# Altium schematic sheet LVDS_IFC.SchDoc: Phaser
size 420 x 297 mm; EDA_Number: ARTIQ; Projet: ARTIQ/SINARA; Author: G.Kasprowicz; CompanyName: WUT ISE; DrawnBy: G.Kasprowicz; Organization: WUT ISE; Address1: PW ISE; Address2: Nowowiejska 15/19 00-665 Warsaw; Address3: gkasprow@gmail.com; DocumentNumber: 15; Revision: 2; SheetNumber: 15; SheetTotal: 18; ModifiedBy: -; CheckedDate: -; Title2: EEM connectors; DivGrp: WUT ISE; Designer: G.Kasprowicz; ModifiedDate: -; ProjectName: Sensor Box
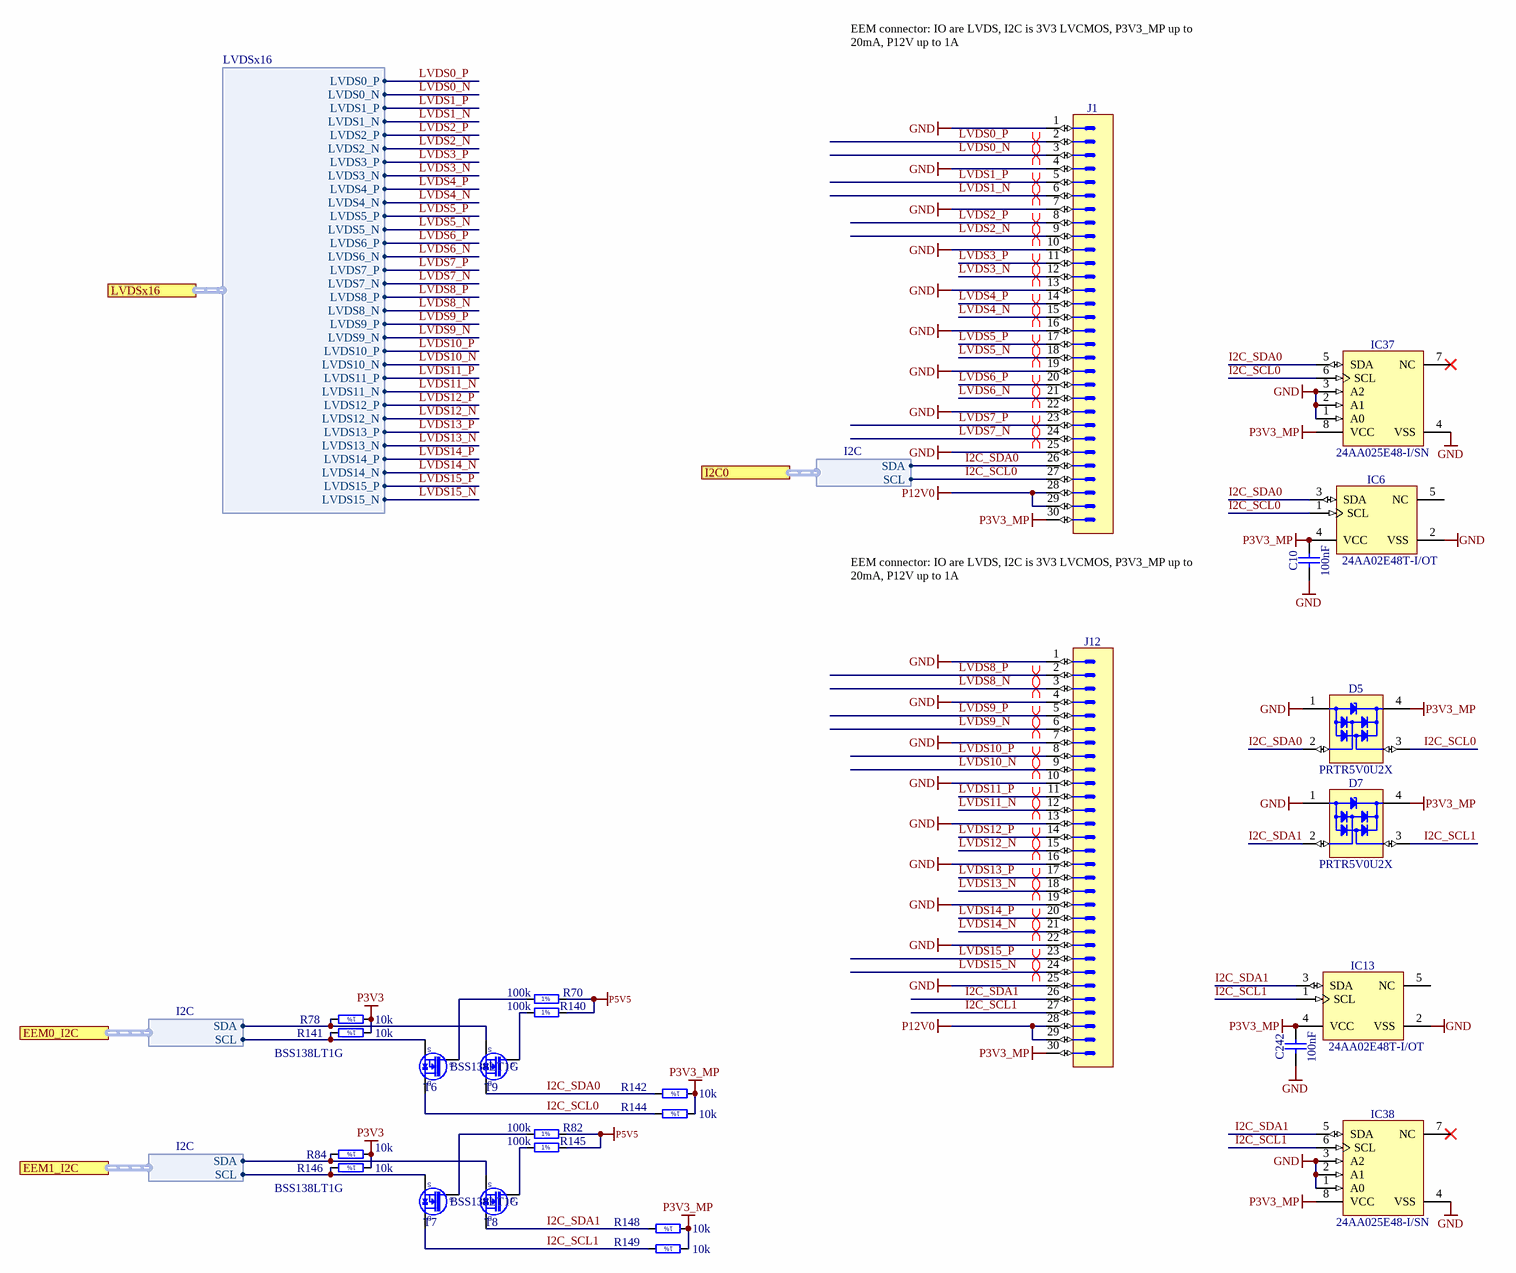
[diagram p0: LVDS_IFC.SchDoc]

## Parts
C10  100nF  [CAPC1005X55N]
C242  100nF  [CAPC1005X55N]
D5  PRTR5V0U2X  [SOT190P230X110-4N]
D7  PRTR5V0U2X  [SOT190P230X110-4N]
IC6  24AA02E48T-I/OT  [SOT95P280X145-5N]
IC13  24AA02E48T-I/OT  [SOT95P280X145-5N]
IC37  24AA025E48-I/SN  [SOIC127P600X175-8N]
IC38  24AA025E48-I/SN  [SOIC127P600X175-8N]
J1  (no value)  [3M_N2530-6002RB]
J12  (no value)  [3M_N2530-6002RB]
R70  100k  [RESC1005X40N]
R78  10k  [RESC1005X40N]
R82  100k  [RESC1005X40N]
R84  10k  [RESC1005X40N]
R140  100k  [RESC1005X40N]
R141  10k  [RESC1005X40N]
R142  10k  [RESC1005X40N]
R144  10k  [RESC1005X40N]
R145  100k  [RESC1005X40N]
R146  10k  [RESC1005X40N]
R148  10k  [RESC1005X40N]
R149  10k  [RESC1005X40N]
T6  BSS138LT1G  [SOT95P240X110-3N]
T7  BSS138LT1G  [SOT95P240X110-3N]
T8  BSS138LT1G  [SOT95P240X110-3N]
T9  BSS138LT1G  [SOT95P240X110-3N]

## Ports
EEM0_I2C (harness I2C), EEM1_I2C (harness I2C), I2C0 (harness I2C), LVDSx16 (harness LVDSx16)

## Harnesses
I2C: SDA, SCL
LVDSx16: LVDS0_P, LVDS0_N, LVDS1_P, LVDS1_N, LVDS2_P, LVDS2_N, LVDS3_P, LVDS3_N, LVDS4_P, LVDS4_N, LVDS5_P, LVDS5_N, LVDS6_P, LVDS6_N, LVDS7_P, LVDS7_N, LVDS8_P, LVDS8_N, LVDS9_P, LVDS9_N, LVDS10_P, LVDS10_N, LVDS11_P, LVDS11_N, LVDS12_P, LVDS12_N, LVDS13_P, LVDS13_N, LVDS14_P, LVDS14_N, LVDS15_P, LVDS15_N

## Nets
GND: C10.1 C242.1 D5.1(GND) D7.1(GND) IC6.2(VSS) IC13.2(VSS) IC37.1(A0) IC37.2(A1) IC37.3(A2) IC37.4(VSS) IC38.1(A0) IC38.2(A1) IC38.3(A2) IC38.4(VSS) J1.1 J1.4 J1.7 J1.10 J1.13 J1.16 J1.19 J1.22 J1.25 J12.1 J12.4 J12.7 J12.10 J12.13 J12.16 J12.19 J12.22 J12.25
P3V3: R78.1 R84.1 R141.1 R146.1
P3V3_MP: C10.2 C242.2 D5.4(VCC) D7.4(VCC) IC6.4(VCC) IC13.4(VCC) IC37.8(VCC) IC38.8(VCC) J1.30 J12.30 R142.1 R144.1 R148.1 R149.1
P5V5: R70.2 R82.2 R140.2 R145.2
P12V0: J1.28 J1.29 J12.28 J12.29
I2C_SCL0: D5.3(I/O2) IC6.1(SCL) IC37.6(SCL) J1.27 R144.2 T6.3(D) ; port I2C0.SCL
I2C_SCL1: D7.3(I/O2) IC13.1(SCL) IC38.6(SCL) J12.27 R149.2 T7.3(D)
I2C_SDA0: D5.2(I/O1) IC6.3(SDA) IC37.5(SDA) J1.26 R142.2 T9.3(D) ; port I2C0.SDA
I2C_SDA1: D7.2(I/O1) IC13.3(SDA) IC38.5(SDA) J12.26 R148.2 T8.3(D)
LVDS0_N: J1.3 ; port LVDSx16.LVDS0_N
LVDS0_P: J1.2 ; port LVDSx16.LVDS0_P
LVDS1_N: J1.6 ; port LVDSx16.LVDS1_N
LVDS1_P: J1.5 ; port LVDSx16.LVDS1_P
LVDS2_N: J1.9 ; port LVDSx16.LVDS2_N
LVDS2_P: J1.8 ; port LVDSx16.LVDS2_P
LVDS3_N: J1.12 ; port LVDSx16.LVDS3_N
LVDS3_P: J1.11 ; port LVDSx16.LVDS3_P
LVDS4_N: J1.15 ; port LVDSx16.LVDS4_N
LVDS4_P: J1.14 ; port LVDSx16.LVDS4_P
LVDS5_N: J1.18 ; port LVDSx16.LVDS5_N
LVDS5_P: J1.17 ; port LVDSx16.LVDS5_P
LVDS6_N: J1.21 ; port LVDSx16.LVDS6_N
LVDS6_P: J1.20 ; port LVDSx16.LVDS6_P
LVDS7_N: J1.24 ; port LVDSx16.LVDS7_N
LVDS7_P: J1.23 ; port LVDSx16.LVDS7_P
LVDS8_N: J12.3 ; port LVDSx16.LVDS8_N
LVDS8_P: J12.2 ; port LVDSx16.LVDS8_P
LVDS9_N: J12.6 ; port LVDSx16.LVDS9_N
LVDS9_P: J12.5 ; port LVDSx16.LVDS9_P
LVDS10_N: J12.9 ; port LVDSx16.LVDS10_N
LVDS10_P: J12.8 ; port LVDSx16.LVDS10_P
LVDS11_N: J12.12 ; port LVDSx16.LVDS11_N
LVDS11_P: J12.11 ; port LVDSx16.LVDS11_P
LVDS12_N: J12.15 ; port LVDSx16.LVDS12_N
LVDS12_P: J12.14 ; port LVDSx16.LVDS12_P
LVDS13_N: J12.18 ; port LVDSx16.LVDS13_N
LVDS13_P: J12.17 ; port LVDSx16.LVDS13_P
LVDS14_N: J12.21 ; port LVDSx16.LVDS14_N
LVDS14_P: J12.20 ; port LVDSx16.LVDS14_P
LVDS15_N: J12.24 ; port LVDSx16.LVDS15_N
LVDS15_P: J12.23 ; port LVDSx16.LVDS15_P
NetR70_1: R70.1 T6.1(G)
NetR78_2: R78.2 T9.2(S) ; port EEM0_I2C.SDA
NetR82_1: R82.1 T7.1(G)
NetR84_2: R84.2 T8.2(S) ; port EEM1_I2C.SDA
NetR140_1: R140.1 T9.1(G)
NetR141_2: R141.2 T6.2(S) ; port EEM0_I2C.SCL
NetR145_1: R145.1 T8.1(G)
NetR146_2: R146.2 T7.2(S) ; port EEM1_I2C.SCL

Not connected (* = marked no-connect by the designer): IC6 5(NC); IC13 5(NC); IC37 7(NC)*; IC38 7(NC)*

## Layout directives
differential pair; differential pair class EEM0; net class EEM0: LVDS0_N, LVDS0_P, LVDS1_N, LVDS1_P, LVDS2_N, LVDS2_P, LVDS3_N, LVDS3_P, LVDS4_N, LVDS4_P, LVDS5_N, LVDS5_P, LVDS6_N, LVDS6_P, LVDS7_N, LVDS7_P
differential pair; differential pair class EEM1; net class EEM1: LVDS8_N, LVDS8_P, LVDS9_N, LVDS9_P, LVDS10_N, LVDS10_P, LVDS11_N, LVDS11_P, LVDS12_N, LVDS12_P, LVDS13_N, LVDS13_P, LVDS14_N, LVDS14_P, LVDS15_N, LVDS15_P
differential pair; differential pair class EEM1: LVDS11_P

## Notes on the sheet
- (near J1) EEM connector: IO are LVDS, I2C is 3V3 LVCMOS, P3V3_MP up to 20mA, P12V up to 1A
- EEM connector: IO are LVDS, I2C is 3V3 LVCMOS, P3V3_MP up to 20mA, P12V up to 1A
- Project/Equipment
- Document
- Designer
- Drawn by
- Check.by
- Copyright WUT ISE 2018.
  This documentation describes Open Hardware and is licensed under the CERN OHL v.1.1. You may redistribute and modify this documentation under the terms of the CERN OHL v.1.1. (http://ohwr.org/CERNOHL). This documentation is distributed WITHOUT ANY EXPRESS OR IMPLIED WARRANTY, INCLUDING OF MERCHANTABILITY, SATISFACTORY QUALITY AND FITNESS FOR A PARTICULAR PURPOSE. Please see the CERN OHL v.1.1 for applicable conditions.
- Contact
- File
- Last Mod.
- Print Date
- Sheet
- Size
- A3
- of
- Rev
- (in symbol R0402_10k_1%_0.0625W_100PPM) 1%
- (in symbol R0402_100K_1%_0.0625W_100PPM) 1%

## Library data of the parts
C10 C242 = CC0402_100NF_16V_10%_X5R: Non-polarised capacitor; Part Description: SMD Multilayer Chip Ceramic Capacitor; Manufacturer: GENERIC; Manufacturer1 Part Number: GRM155R61C104KA88D; Voltage: 16V; TC: X5R; Tolerance: ±10%; Part Number: CC0402_100NF_16V_10%_X5R; Component Kind: Standard; Component Type: Standard; Pin Count: 2; Value: 100nF; Status: None; Manufacturer Part Number: CC0402_100NF_16V_10%_X5R; Case: 0402; Mounted: Yes; Socket: No; SMD: Yes; Sense: No; Manufacturer1 Example: MURATA; Manufacturer1 ComponentHeight: 0.55mm; HelpURL: \\cern.ch\dfs\Applications\Altium\Datasheets\CC0402_X5R_MURATA_GRM.pdf; Author: CERN DEM JLC; CreateDate: 10.12.2013; LatestRevisionDate: 10.12.2013
D5 D7 = PRTR5V0U2X: Ultra Low Capacitance Double Rail-to-Rail ESD Protection Diode; Part Description: Ultra Low Capacitance (1pF) Double Rail-to-Rail ESD Protection Diode (8kV); Manufacturer: NXP SEMICONDUCTORS; Voltage: 5.5V; PressFit: No; Bonding: No; Part Number: PRTR5V0U2X; Component Kind: Standard; Component Type: Standard; Device: PRTR5V0U2X; PackageDescription: SOT143B, SOT, 1.90mm Pitch; 4 Pin, 1.30mm W X 2.90mm L X 1.10mm H body, IPC Medium Density; Manufacturer Part Number: PRTR5V0U2X; Pin Count: 4; Case: SOT143B; Mounted: Yes; Socket: No; SMD: Yes; Sense: No; ComponentHeight: 1.1mm; HelpURL: \\cern.ch\dfs\Applications\Altium\Datasheets\PRTR5V0U2X.pdf; Author: CERN DEM JLC; CreateDate: 22.03.2011; LatestRevisionDate: 22.03.2011
IC6 IC13 = 24AA02E48T-I/OT: 1.7V-5.5V, 2K I2C Serial EEPROM With EUI-48 Node Identity; Manufacturer: MICROCHIP TECHNOLOGY; PressFit: No; Bonding: No; Part Number: 24AA02E48T-I/OT; Component Kind: Standard; Component Type: Standard; Device: 24AA02E48T-I/OT; PackageDescription: SOT, 0.95mm pitch; 5 pin, 1.60mm W X 2.90mm L X 1.45mm H body, IPC Medium Density; Part Description: 1.7V-5.5V, 2K I2C Serial EEPROM With EUI-48 Node Identity; Manufacturer Part Number: 24AA02E48T-I/OT; Pin Count: 5; Case: SOT23-5; Mounted: Yes; Socket: No; SMD: Yes; Sense: No; ComponentHeight: 1.45mm; HelpURL: \\cern.ch\dfs\Applications\Altium\Datasheets\24AA02E48T-I-OT.pdf; Author: CERN DEM MR; CreateDate: 31.03.2016; LatestRevisionDate: 31.03.2016
IC37 IC38 = 24AA025E48-I/SN: 1.7V-5.5V, 2K I2C™ Serial EEPROMs with EUI-48™ Node Identity; Manufacturer: MICROCHIP TECHNOLOGY; PressFit: No; Bonding: No; Part Number: 24AA025E48-I/SN; Component Kind: Standard; Component Type: Standard; Device: 24AA025E48-I/SN; PackageDescription: SOIC 8, Pitch 1.27mm - Body 4x5mm, IPC Medium Density; Part Description: 1.7V-5.5V, 2K I2C™ Serial EEPROMs with EUI-48™ Node Identity; Manufacturer Part Number: 24AA025E48-I/SN; Pin Count: 8; Case: SOIC8; Mounted: Yes; Socket: No; SMD: Yes; Sense: No; ComponentHeight: 1.75mm; HelpURL: \\cern.ch\dfs\Applications\Altium\Datasheets\24AA025E48-I-SN.pdf; Author: CERN DEM MR; CreateDate: 19.07.2016; LatestRevisionDate: 19.07.2016
J1 J12 = 3M_N2530-6002RB: Connector 30 Male; Part Description: 30 Contacts - Straight .100'' x .100'' Low Profile Four-Wall Header, 2500 Series; Manufacturer: 3M; PressFit: No; Part Number: 3M_N2530-6002RB; Component Kind: Standard; Component Type: Standard; Pin Count: 30; Family: Header 30; Mounted: Yes; Socket: No; SMD: No; Sense: No; Status: None; Manufacturer Part Number: N2530-6002RB; ComponentHeight: 10.03mm; HelpURL: \\cern.ch\dfs\Applications\Altium\Datasheets\3M_N2530-6002RB.pdf; Author: CERN DEM JLC; CreateDate: 11.02.2009; LatestRevisionDate: 11.08.2009
R70 R82 R140 R145 = R0402_100K_1%_0.0625W_100PPM: Resistor - 1%; Part Description: General Purpose Thick Film Chip Resistor; Manufacturer: GENERIC; Manufacturer1 Part Number: 232270671004L; TC: ±100ppm/°C; PressFit: No; Part Number: R0402_100K_1%_0.0625W_100PPM; Component Kind: Standard; Component Type: Standard; Pin Count: 2; Value: 100k; Status: Not Recommended; Power: 0.0625W; Tolerance: ±1%; Manufacturer Part Number: R0402_100K_1%_0.0625W_100PPM; Case: 0402; Mounted: Yes; Sense: No; Socket: No; SMD: Yes; Manufacturer1 Example: YAGEO PHYCOMP; Manufacturer1 ComponentHeight: 0.4mm; HelpURL: \\cern.ch\dfs\Applications\Altium\Datasheets\R0402_Phycomp_RC0402.pdf; Author: CERN DEM JLC; CreateDate: 03/12/2007; LatestRevisionDate: 17/10/2012
R78 R84 R141 R142 R144 R146 R148 R149 = R0402_10k_1%_0.0625W_100PPM: Resistor - 1%; Part Description: General Purpose Thick Film Chip Resistor; Manufacturer: GENERIC; Manufacturer1 Part Number: 232270671003L; TC: ±100ppm/°C; PressFit: No; Part Number: R0402_10K_1%_0.0625W_100PPM; Component Kind: Standard; Component Type: Standard; Pin Count: 2; Value: 10k; Status: Not Recommended; Power: 0.0625W; Tolerance: ±1%; Manufacturer Part Number: R0402_10K_1%_0.0625W_100PPM; Case: 0402; Mounted: Yes; Sense: No; Socket: No; SMD: Yes; Manufacturer1 Example: YAGEO PHYCOMP; Manufacturer1 ComponentHeight: 0.4mm; HelpURL: \\cern.ch\dfs\Applications\Altium\Datasheets\R0402_Phycomp_RC0402.pdf; Author: CERN DEM JLC; CreateDate: 03.12.2007; LatestRevisionDate: 17.10.2012
T6-T9 = BSS138LT1G: N-CHANNEL MOSFET WITH DIODE; Part Description: 50V 200mA N-Channel Enhancement Mode Field-Effect Transistor; Manufacturer: ON SEMICONDUCTOR; PressFit: No; Bonding: No; Part Number: BSS138LT1G; Component Kind: Standard; Component Type: Standard; Device: BSS138LT1G; PackageDescription: SOT23 3-Leads, Pitch 0.95mm - Body 1.4x3mm, IPC Medium Density; Manufacturer Part Number: BSS138LT1G; Pin Count: 3; Case: SOT23-3; Mounted: Yes; Socket: No; SMD: Yes; Sense: No; ComponentHeight: 1.11mm; HelpURL: \\cern.ch\dfs\Applications\Altium\Datasheets\BSS138LT1G.pdf; Author: CERN DEM JLC; CreateDate: 23.03.2009; LatestRevisionDate: 23.03.2009